# EAGLE schematic Speed Controller v1.0 (EAGLE 6.3)
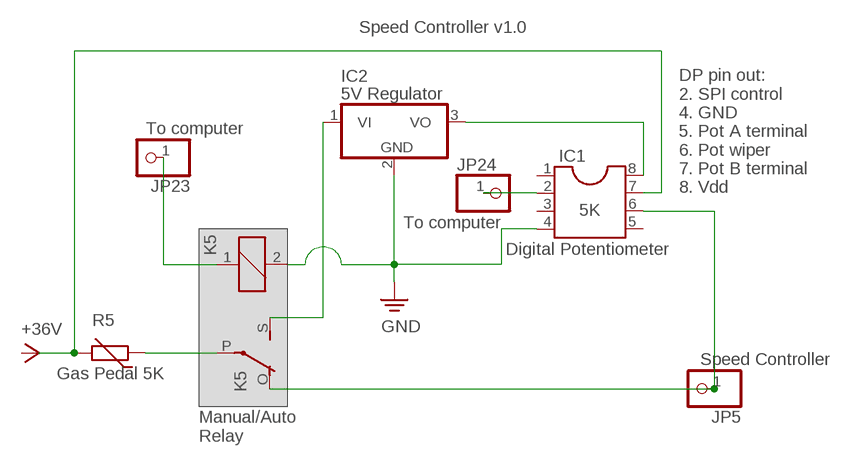
[diagram p0: schematic, sheet 1]

## Parts
IC1  Digital Potentiometer  DIL8  [DIL08]
IC2  5V Regulator  7805T  [TO220H]
JP5  Speed Controller  PINHD-1X1  [1X01]
JP23  To computer  PINHD-1X1  [1X01]
JP24  To computer  PINHD-1X1  [1X01]
K5  G2R  [G2R]
R5  Gas Pedal 5K  THERMISTOR_R-5  [R-5]

## Nets
N$15: IC2.1(VI) K5.S(2:S)
N$84: IC1.7 R5.2
N$85: IC1.6 JP5.1 K5.O(2:O)
N$86: K5.P(2:P) R5.1
N$87: JP23.1 K5.1
N$90: IC1.2 JP24.1
PE: IC1.4 IC2.2(GND) K5.2 ; supply symbol labelled GND
VCC1: IC1.8 IC2.3(VO)
Unconnected: IC1.1 IC1.3 IC1.5

## Notes on the sheet
- Speed Controller v1.0
- DP pin out:
  2. SPI control
  4. GND
  5. Pot A terminal
  6. Pot wiper
  7. Pot B terminal
  8. Vdd
- 5K
- Manual/Auto
  Relay

## Library data of the parts
IC1 = ic-package:DIL8: Dual In Line / Socket
IC2 = linear:78*: Positive VOLTAGE REGULATOR Source: http://cache.national.com/ds/LM/LM78L05.pdf http://www.fairchildsemi.com/ds/LM/LM7805.pdf
JP5 JP23 JP24 = adafruit:PINHD-1X1: Pin header 1x1 for 0.1" spacing With round pins
K5 = relay:G2R: RELAY 1 x switch, Omron; OC_FARNELL: 1569185; OC_NEWARK: unknown
R5 = discrete:THERMISTOR_: Thermo Resistor